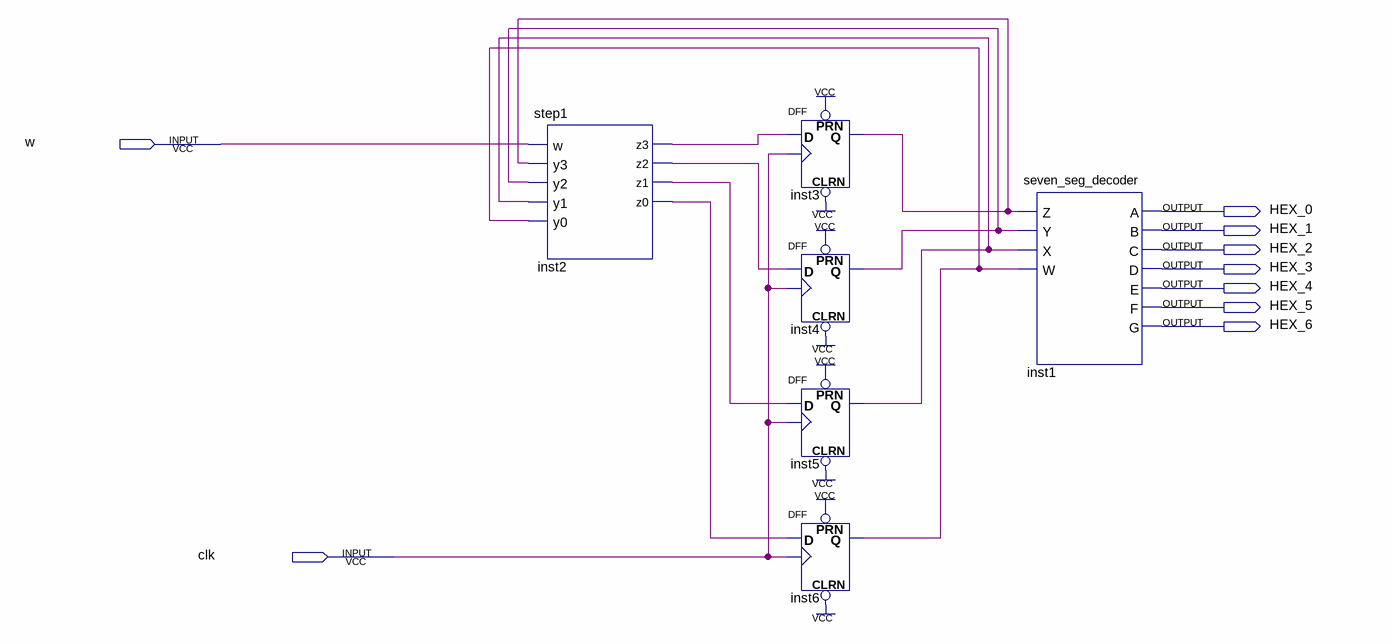
[diagram p0: schematic sheet]
// Quartus schematic labFinalstep1.bdf as structural Verilog: 6 symbols, 9 pins
module labFinalstep1 (
  input  w,
  input  clk,
  output HEX_0,
  output HEX_1,
  output HEX_2,
  output HEX_3,
  output HEX_4,
  output HEX_5,
  output HEX_6
);

  wire inst2_z0, inst2_z1, inst2_z2, inst2_z3, inst3_q, inst4_q, inst5_q, inst6_q;

  step1 inst2 (
    .w(w), .y3(inst3_q), .y2(inst4_q), .y1(inst5_q), .y0(inst6_q), .z3(inst2_z3), .z2(inst2_z2),
    .z1(inst2_z1), .z0(inst2_z0));
  DFF inst3 (.CLRN(1'b1), .CLK(clk), .D(inst2_z3), .PRN(1'b1), .Q(inst3_q));
  DFF inst4 (.CLRN(1'b1), .CLK(clk), .D(inst2_z2), .PRN(1'b1), .Q(inst4_q));
  DFF inst5 (.CLRN(1'b1), .CLK(clk), .D(inst2_z1), .PRN(1'b1), .Q(inst5_q));
  DFF inst6 (.CLRN(1'b1), .CLK(clk), .D(inst2_z0), .PRN(1'b1), .Q(inst6_q));
  seven_seg_decoder inst1 (
    .Z(inst3_q), .Y(inst4_q), .X(inst5_q), .W(inst6_q), .A(HEX_0), .B(HEX_1), .C(HEX_2), .D(HEX_3),
    .E(HEX_4), .F(HEX_5), .G(HEX_6));
endmodule
